# Altium schematic sheet Status_LEDs.SchDoc
size A; SheetNumber: 1; SheetTotal: 3
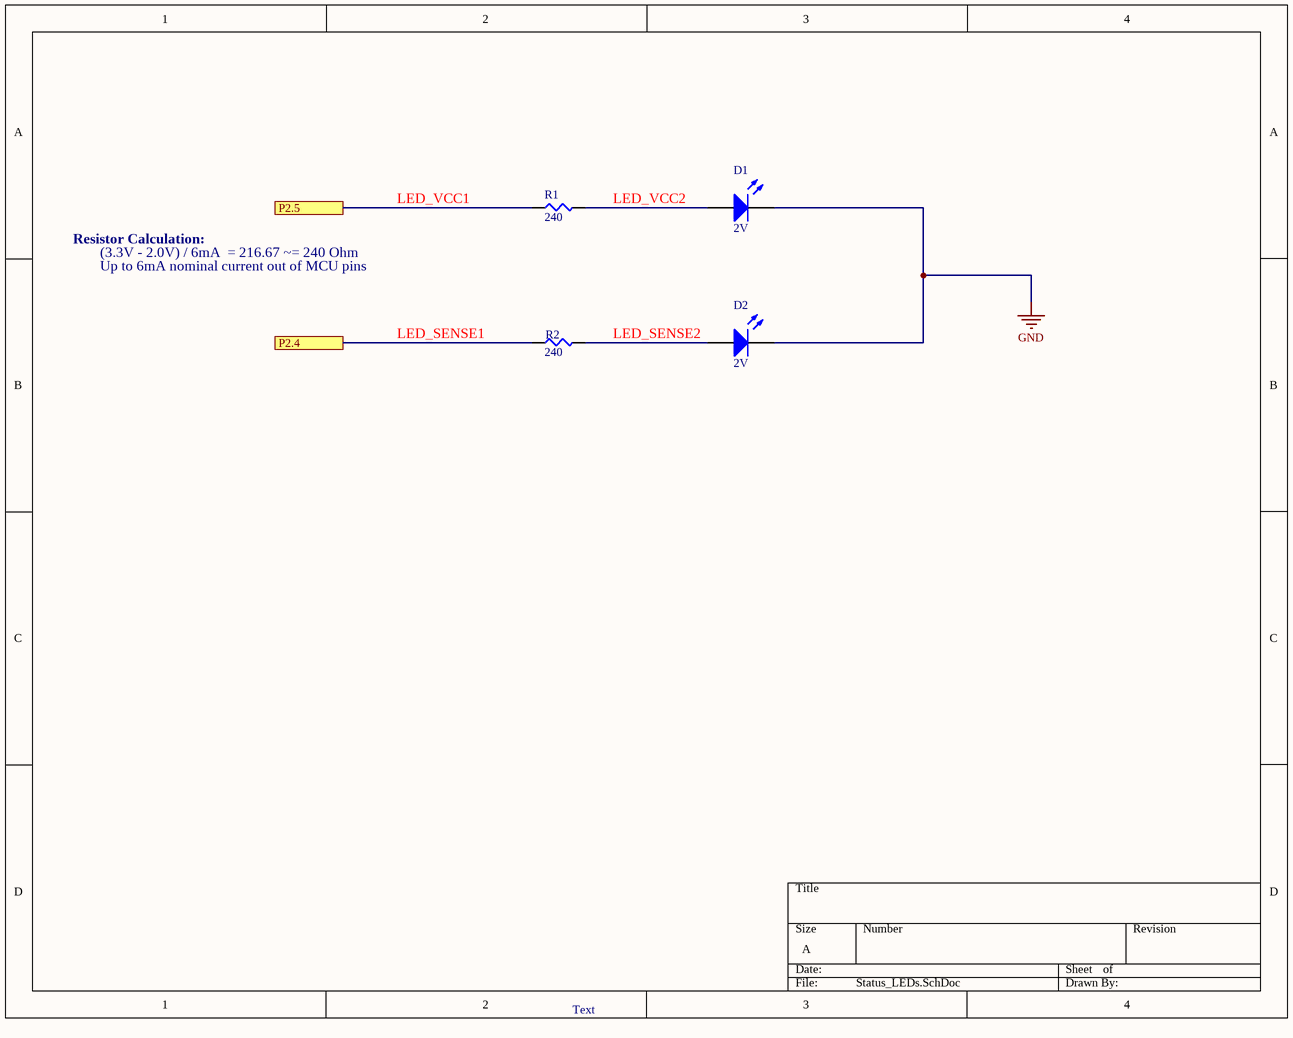
[diagram p0: Status_LEDs.SchDoc]

## Parts
D1  2V  [0805_A]
D2  2V  [0805_A]
R1  240  [SMD-0805-RES]
R2  240  [SMD-0805-RES]

## Ports
P2.4, P2.5

## Nets
GND: D1.1(K) D2.1(K)
P2.4: R2.1 ; port P2.4
P2.5: R1.1 ; port P2.5
NetD1_2: D1.2(A) R1.2
NetD2_2: D2.2(A) R2.2

## Notes on the sheet
- LED_VCC1
- LED_VCC2
- Resistor Calculation:
- (3.3V - 2.0V) / 6mA  = 216.67 ~= 240 Ohm
- Up to 6mA nominal current out of MCU pins
- LED_SENSE1
- LED_SENSE2
- Text

## Library data of the parts
D1 D2 = CMP-1426-00009-1: SMD mono-color Chip LED, WL-SMCW, Bright Green; PartNumber: 150080VS75000; Manufacturer: Wuerth Elektronik; ComponentLink1Description: Manufacturer URL; Color: Bright Green; PackageReference: 0805_A; ComponentLink1URL: http://www.we-online.com; ComponentLink2Description: Datasheet; ComponentLink2URL: http://katalog.we-online.com/led/datasheet/150080VS75000.pdf
R1 R2 = ERJ-6ENF2400V: RES SMD 240 OHM 1% 1/8W 0805; Manufacturer: Panasonic Electronic Components; Factory Stock: 0; Unit Price (USD): 0.00729; @ qty: 1500; Minimum Quantity: 1; Power (Watts): 0.125W, 1/8W; Temperature Coefficient: ±100ppm/°C; Part Number: ERJ-6ENF2400V; Datasheets: http://industrial.panasonic.com/www-cgi/jvcr13pz.cgi?E+PZ+3+AOA0002+ERJ6ENF2400V+7+WW; Image: //media.digikey.com/Renders/Panasonic%20Renders/ERJ-0805%20Pkg.jpg; Digi-Key Part Number: P240CCT-ND; Quantity Available: 62802; Packaging: Cut Tape (CT); Series: ERJ; Part Status: Active; Value: 240; Tolerance: ±1%; Composition: Thick Film; Features: Automotive AEC-Q200; Operating Temperature: -55°C ~ 155°C; Package / Case: 0805 (2012 Metric); Supplier Device Package: 0805; Size / Dimension: 0.079" L x 0.049" W (2.00mm x 1.25mm); Height - Seated (Max): 0.028" (0.70mm); Number of Terminations: 2; Failure Rate: -